# Altium project Freqency_counter.PrjPcb
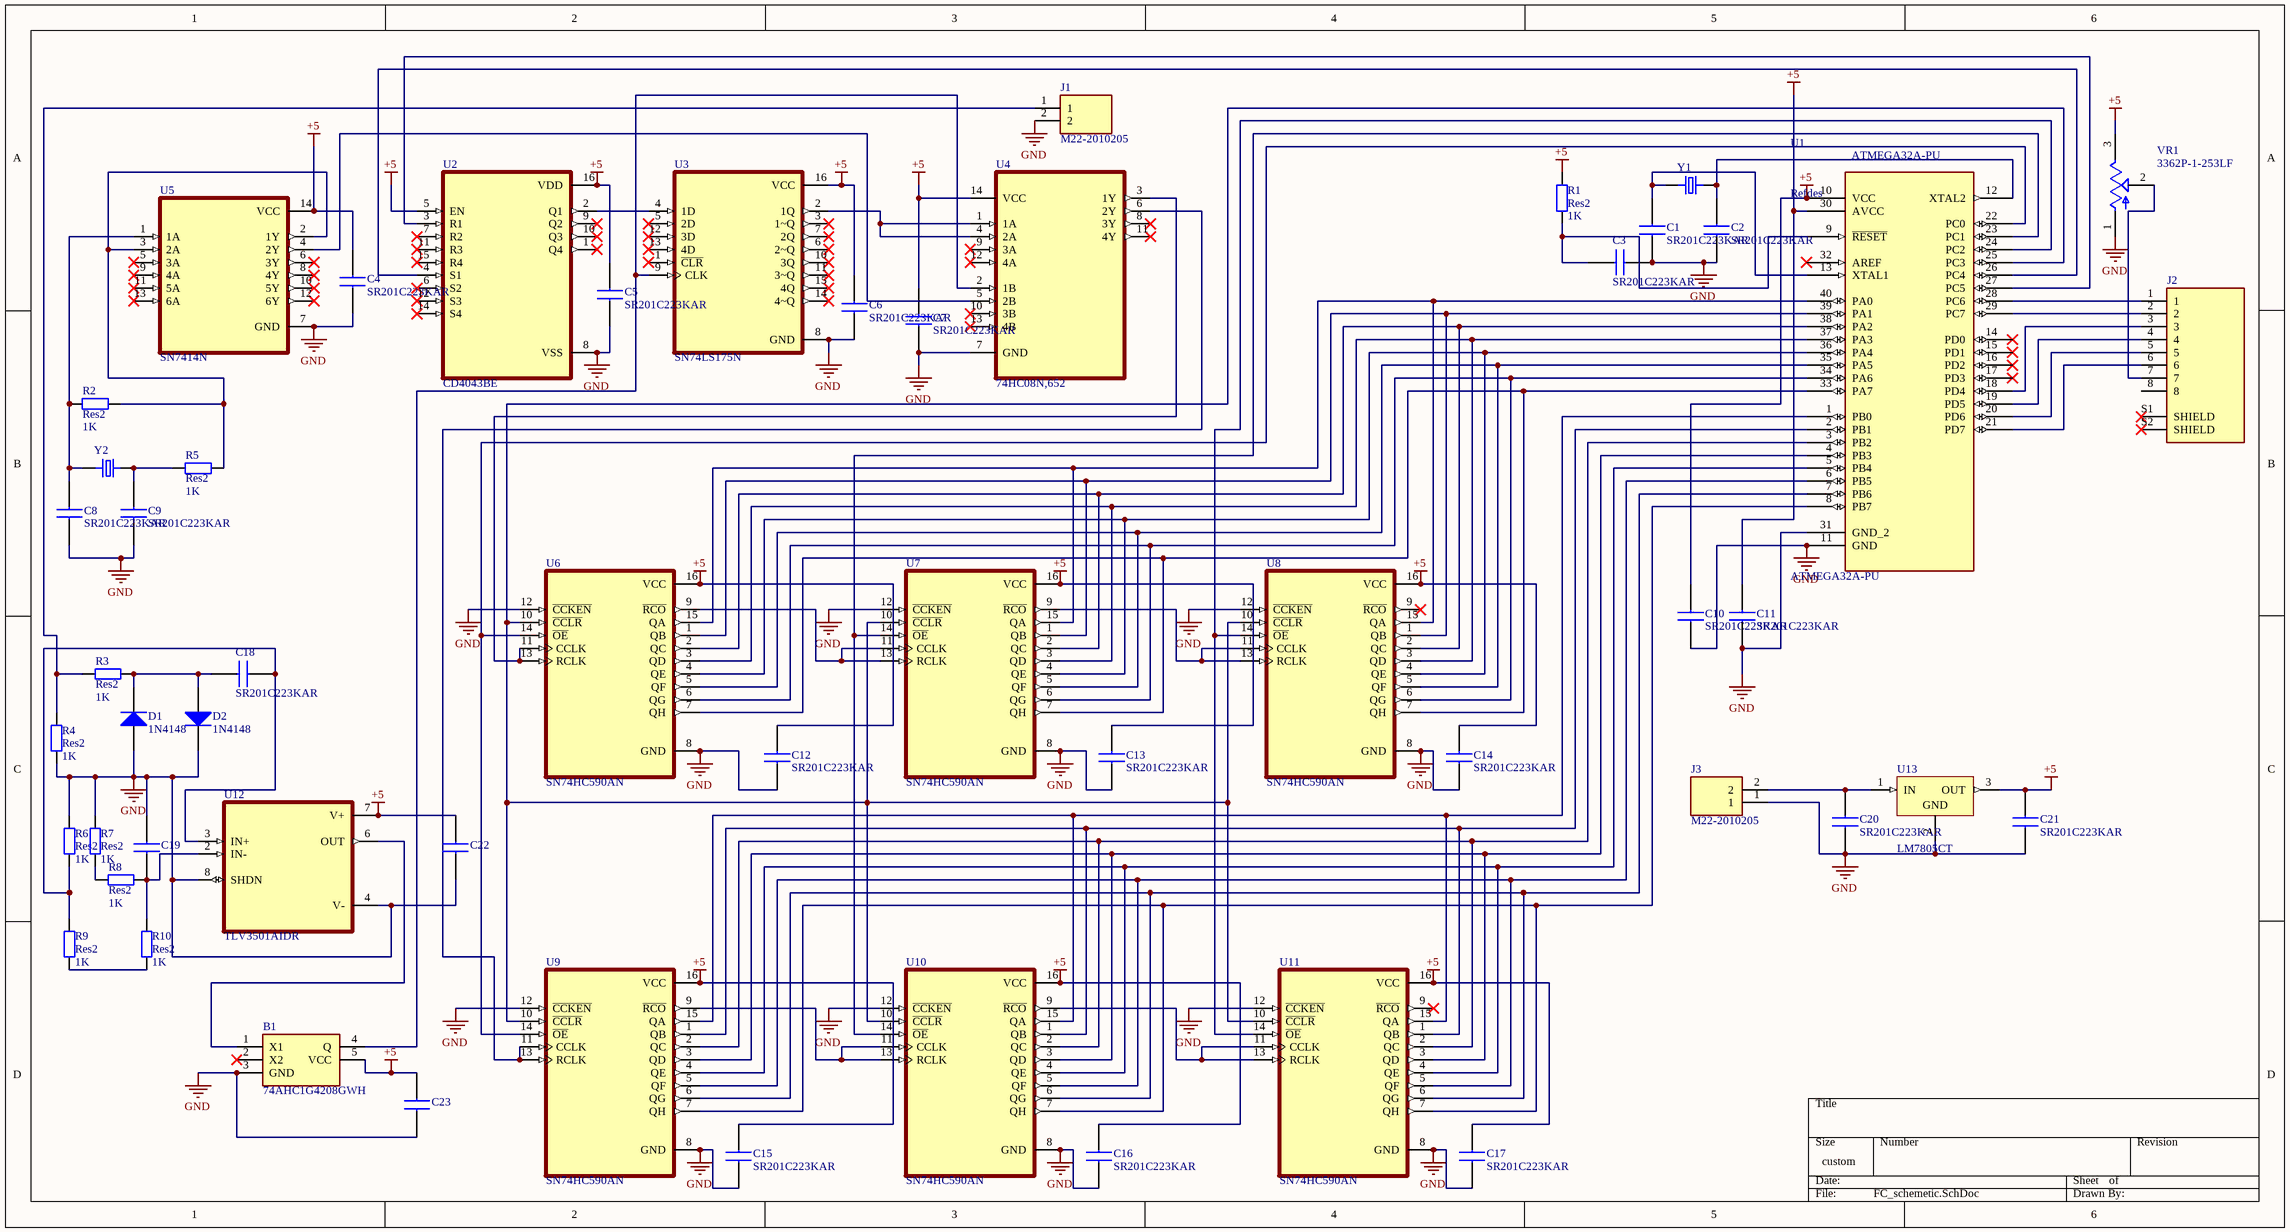
[diagram p0: FC_schemetic.SchDoc]
4 sheets, 110 parts. Net scope: global (net labels, ports and power ports of the same name join across sheets).
Board files: PCB.PcbDoc, PCB_final.PcbDoc
Sheets:
  FC_schemetic.SchDoc
  CPU.SchDoc
  Process.SchDoc
  Input.SchDoc

## Sheet FC_schemetic.SchDoc
size 449 x 241 mm; SheetNumber: 1; SheetTotal: 2; SPICEModelCacheGWGPYTAI: <root> / <DocumentId>GWGPYTAI</DocumentId> / <CacheFrame Number="0"> / <Model Name="xtal" Kind="CKT"> / <Text>*Generic type:crystal pkg:HC33/51 / .SUBCKT XTAL 1 2 PARAMS: FREQ=1Meg RS=750 C=13pf Q=1000 / LX 1 3 {((Q*RS)/(6.2831852*FREQ))} IC=0.5M / CX 3 4 {(1/(Q*6.2831852*FREQ*RS))} / C0 1 2 {C} / RS 4 2 {RS} / .ENDS XTAL</Text> / </Model> / <Model Name="cap" Kind="MDL"> / <Text>*Default semiconductor capacitor / .MODEL CAP C()</Text> / </Model> / <Model Name="11dq03" Kind="MDL"> / <Text>*11DQ03 MCE 7-17-95 / *Ref: IR Power Semiconductors Product Digest '94 / *MCE 30V 1.1A pkg:DIODE0.4 1,2 / .MODEL 11DQ03 D(IS=5.18E-9 RS=0.146 N=0.878 TT=4.32E-6 CJO=1.18E-10 / + VJ=0.75 M=0.333 EG=0.69 XTI=2 BV=30 IBV=6.01E-6 )</Text> / </Model> / </CacheFrame> / </root>

### Parts
B1  74AHC1G4208GWH  [SOT65P212X110-5N]
C1  SR201C223KAR  [AVX-SR20]
C2  SR201C223KAR  [AVX-SR20]
C3  SR201C223KAR  [AVX-SR20]
C4  SR201C223KAR  [AVX-SR20]
C5  SR201C223KAR  [AVX-SR20]
C6  SR201C223KAR  [AVX-SR20]
C7  SR201C223KAR  [AVX-SR20]
C8  SR201C223KAR  [AVX-SR20]
C9  SR201C223KAR  [AVX-SR20]
C10  SR201C223KAR  [AVX-SR20]
C11  SR201C223KAR  [AVX-SR20]
C12  SR201C223KAR  [AVX-SR20]
C13  SR201C223KAR  [AVX-SR20]
C14  SR201C223KAR  [AVX-SR20]
C15  SR201C223KAR  [AVX-SR20]
C16  SR201C223KAR  [AVX-SR20]
C17  SR201C223KAR  [AVX-SR20]
C18  SR201C223KAR  [AVX-SR20]
C19  SR201C223KAR  [AVX-SR20]  (value not drawn)
C20  SR201C223KAR  [AVX-SR20]
C21  SR201C223KAR  [AVX-SR20]
C22  SR201C223KAR  [AVX-SR20]  (value not drawn)
C23  SR201C223KAR  [AVX-SR20]  (value not drawn)
D1  1N4148  [NXP-SOD27-2_V]
D2  1N4148  [NXP-SOD27-2_V]
J1  M22-2010205  [HDRV2W50P0X200_1X2_400X200X525P]
J2  59453-082110EDHLF  [AMPHENOL_59453-082110EDHLF]  (value not drawn)
J3  M22-2010205  [HDRV2W50P0X200_1X2_400X200X525P]
R1  Res2  value 1K  [AXIAL-0.4]
R2  Res2  value 1K  [AXIAL-0.4]
R3  Res2  value 1K  [AXIAL-0.4]
R4  Res2  value 1K  [AXIAL-0.4]
R5  Res2  value 1K  [AXIAL-0.4]
R6  Res2  value 1K  [AXIAL-0.4]
R7  Res2  value 1K  [AXIAL-0.4]
R8  Res2  value 1K  [AXIAL-0.4]
R9  Res2  value 1K  [AXIAL-0.4]
R10  Res2  value 1K  [AXIAL-0.4]
U1  ATMEGA32A-PU  [DIP254P1524X482-40]
U2  CD4043BE  [DIP794W45P254L1969H508Q16]
U3  SN74LS175N  [DIP794W45P254L1969H508Q16]
U4  74HC08N,652  [DIP254P762X420-14]
U5  SN7414N  [DIP794W45P254L1969H508Q14]
U6  SN74HC590AN  [DIP794W45P254L1969H508Q16]
U7  SN74HC590AN  [DIP794W45P254L1969H508Q16]
U8  SN74HC590AN  [DIP794W45P254L1969H508Q16]
U9  SN74HC590AN  [DIP794W45P254L1969H508Q16]
U10  SN74HC590AN  [DIP794W45P254L1969H508Q16]
U11  SN74HC590AN  [DIP794W45P254L1969H508Q16]
U12  TLV3501AIDR  [SOIC127P599X175-8N]
U13  LM7805CT  [FAIR-TO-220-3]
VR1  3362P-1-253LF  [TRIM_3362P-1-253LF]
Y1  ECS-240.0001-18-1X  [XTAL_ECS-200-20-1X]  (value not drawn)
Y2  ECS-240.0001-18-1X  [XTAL_ECS-200-20-1X]  (value not drawn)

### Nets
+5: B1.3(GND) B1.5(VCC) C1.1 C2.1 C3.1 C4.1 C4.2 C5.1 C5.2 C6.1 C6.2 C7.1 C7.2 C8.1 C9.1 C10.1 C10.2 C11.1 C11.2 C12.1 C12.2 C13.1 C13.2 C14.1 C14.2 C15.1 C15.2 C16.1 C16.2 C17.1 C17.2 C19.1 C20.1 C21.1 C21.2 C22.1 C22.2 C23.1 C23.2 D1.1(A) D2.2(K) J1.2 J3.1 R1.2 R4.2 R6.1 R7.1 U1.10(VCC) U1.11(GND) U1.30(AVCC) U1.31(GND_2) U2.5(EN) U2.8(VSS) U2.16(VDD) U3.8(GND) U3.16(VCC) U4.7(GND) U4.14(VCC) U5.7(GND) U5.14(VCC) U6.8(GND) U6.12(~{CCKEN}) U6.16(VCC) U7.8(GND) U7.12(~{CCKEN}) U7.16(VCC) U8.8(GND) U8.12(~{CCKEN}) U8.16(VCC) U9.8(GND) U9.12(~{CCKEN}) U9.16(VCC) U10.8(GND) U10.12(~{CCKEN}) U10.16(VCC) U11.8(GND) U11.12(~{CCKEN}) U11.16(VCC) U12.4(V-) U12.7(V+) U12.8(SHDN) U13.2(GND) U13.3(OUT) VR1.1(CCW) VR1.3(CW)  [also labelled GND]  [project net Atmega_AVCC]
NetB1_1: B1.1(X1) U12.6(OUT)
NetB1_4: B1.4(Q) U3.9(CLK) U4.2(1B)
NetC1_2: C1.2 U1.13(XTAL1) Y1.1
NetC2_2: C2.2 U1.12(XTAL2) Y1.2
NetC3_2: C3.2 R1.1 U1.9(~{RESET})
NetC8_2: C8.2 R2.2 U5.1(1A) Y2.1
NetC9_2: C9.2 R5.2 Y2.2
NetC18_1: C18.1 R6.2 R9.1 U12.3(IN+)
NetC18_2: C18.2 D1.2(K) D2.1(A) R3.1
NetC19_2: C19.2 R8.2 R10.1 U12.2(IN-)
NetC20_2: C20.2 J3.2 U13.1(IN)
NetJ1_1: J1.1 R3.2 R4.1
NetJ2_1: J2.1 U1.28(PC6)
NetJ2_2: J2.2 U1.29(PC7)
NetJ2_3: J2.3 U1.18(PD4)
NetJ2_4: J2.4 U1.19(PD5)
NetJ2_5: J2.5 U1.20(PD6)
NetJ2_6: J2.6 U1.21(PD7)
NetJ2_7: J2.7 VR1.2(WIPER)
NetR2_1: R2.1 R5.1 U5.2(1Y) U5.3(2A)
NetR7_2: R7.2 R8.1
NetR9_2: R9.2 R10.2
NetU1_1: U1.1(PB0) U9.15(QA) U10.15(QA) U11.15(QA)
NetU1_2: U1.2(PB1) U9.1(QB) U10.1(QB) U11.1(QB)
NetU1_3: U1.3(PB2) U9.2(QC) U10.2(QC) U11.2(QC)
NetU1_4: U1.4(PB3) U9.3(QD) U10.3(QD) U11.3(QD)
NetU1_5: U1.5(PB4) U9.4(QE) U10.4(QE) U11.4(QE)
NetU1_6: U1.6(PB5) U9.5(QF) U10.5(QF) U11.5(QF)
NetU1_7: U1.7(PB6) U9.6(QG) U10.6(QG) U11.6(QG)
NetU1_8: U1.8(PB7) U9.7(QH) U10.7(QH) U11.7(QH)
NetU1_22: U1.22(PC0) U6.14(~{OE}) U9.14(~{OE})
NetU1_23: U1.23(PC1) U7.14(~{OE}) U10.14(~{OE})
NetU1_24: U1.24(PC2) U8.14(~{OE}) U11.14(~{OE})
NetU1_25: U1.25(PC3) U6.10(~{CCLR}) U7.10(~{CCLR}) U8.10(~{CCLR}) U9.10(~{CCLR}) U10.10(~{CCLR}) U11.10(~{CCLR})
NetU1_26: U1.26(PC4) U2.4(S1)
NetU1_27: U1.27(PC5) U2.3(R1)
NetU1_33: U1.33(PA7) U6.7(QH) U7.7(QH) U8.7(QH)
NetU1_34: U1.34(PA6) U6.6(QG) U7.6(QG) U8.6(QG)
NetU1_35: U1.35(PA5) U6.5(QF) U7.5(QF) U8.5(QF)
NetU1_36: U1.36(PA4) U6.4(QE) U7.4(QE) U8.4(QE)
NetU1_37: U1.37(PA3) U6.3(QD) U7.3(QD) U8.3(QD)
NetU1_38: U1.38(PA2) U6.2(QC) U7.2(QC) U8.2(QC)
NetU1_39: U1.39(PA1) U6.1(QB) U7.1(QB) U8.1(QB)
NetU1_40: U1.40(PA0) U6.15(QA) U7.15(QA) U8.15(QA)
NetU2_2: U2.2(Q1) U3.4(1D)
NetU3_2: U3.2(1Q) U4.1(1A) U4.4(2A)
NetU4_3: U4.3(1Y) U6.11(CCLK) U6.13(RCLK)
NetU4_5: U4.5(2B) U5.4(2Y)
NetU4_6: U4.6(2Y) U9.11(CCLK) U9.13(RCLK)
NetU6_9: U6.9(~{RCO}) U7.11(CCLK) U7.13(RCLK)
NetU7_9: U7.9(~{RCO}) U8.11(CCLK) U8.13(RCLK)
NetU9_9: U9.9(~{RCO}) U10.11(CCLK) U10.13(RCLK)
NetU10_9: U10.9(~{RCO}) U11.11(CCLK) U11.13(RCLK)

Not connected (* = marked no-connect by the designer): B1 2(X2)*; J2 8 S1(SHIELD)* S2(SHIELD)*; U1 14(PD0)* 15(PD1)* 16(PD2)* 17(PD3)* 32(AREF)*; U2 1(Q4)* 6(S2)* 7(R2)* 9(Q2)* 10(Q3)* 11(R3)* 12(S3)* 14(S4)* 15(R4)*; U3 1(~{CLR})* 3(1~Q)* 5(2D)* 6(2~Q)* 7(2Q)* 10(3Q)* 11(3~Q)* 12(3D)* 13(4D)* 14(4~Q)* 15(4Q)*; U4 8(3Y)* 9(3A)* 10(3B)* 11(4Y)* 12(4A)* 13(4B)*; U5 5(3A)* 6(3Y)* 8(4Y)* 9(4A)* 10(5Y)* 11(5A)* 12(6Y)* 13(6A)*; U8 9(~{RCO})*; U11 9(~{RCO})*

### Notes on the sheet
- (in symbol ATMEGA32A-PU) Refdes

### Library data of the parts
B1 = 74AHC1G4208GWH: vp_74AHC1G4208.ditamap - 8-stage divider and oscillator@en-us; Manufacturer_Name: Nexperia; Geometry.Height: 1.1mm; Manufacturer_Part_Number: 74AHC1G4208GWH; Mouser Part Number: 771-74AHC1G4208GWH; Mouser Price/Stock: https://www.mouser.co.uk/ProductDetail/Nexperia/74AHC1G4208GWH?qs=17u8i%2FzlE8%2FxKrIMt8zS2A%3D%3D; Arrow Part Number: 74AHC1G4208GWH; Arrow Price/Stock: https://www.arrow.com/en/products/74ahc1g4208gwh/nexperia?region=nac; Datasheet Link: https://assets.nexperia.com/documents/data-sheet/74AHC1G4208.pdf
C1-C23 = SR201C223KAR: Cap Ceramic 0.022uF 100V X7R 10% Radial 2.54mm 125C Bulk; Manufacturer_Name: AVX; Manufacturer_Part_Number: SR201C223KAR; Mouser Part Number: *; Mouser Price/Stock: *; Arrow Part Number: SR201C223KAR; Arrow Price/Stock: https://www.arrow.com/en/products/sr201c223kar/avx; Datasheet Link: http://datasheets.avx.com/SR-Series.pdf
D1 D2 = CMP-004-00000-2: High Speed Diode, 100 V, 0.45 A, -65 to 175 degC, 2-Pin SOD27, RoHS, Bulk; Manufacturer: Fairchild; Elements: 1; Recovery Time: 4ns; Forward Current: 300mA; Power: 500mW; Forward Voltage: 1V; Max Surge Current: 4A; Peak Reverse Current: 5uA; Datasheet URL: http://www.nxp.com/documents/data_sheet/1N4148_1N4448.pdf; Min Operating Temperature: -65°C; Manufacturer URL: https://www.fairchildsemi.com/; Packaging: Bulk; Diameter: 1.91mm; Pins: 2; Package URL: http://www.nxp.com/documents/data_sheet/1N4148_1N4448.pdf; Package Reference: SOD27; Max Operating Temperature: 175°C; Package Quantity: 2000; Case/Package: DO; Datasheet Version: Aug-04; RoHS Compliant: True
J1 J3 = M22-2010205: Header, SIL, vertical, 2 way, 2mm pitch HARWIN M22-20 Series, 2mm Pitch 2 Way 1 Row Straight PCB Header, Solder Termination, 1A; Geometry.Height: 5.25mm; Manufacturer_Name: Harwin; Manufacturer_Part_Number: M22-2010205; Mouser Part Number: 855-M22-2010205; Mouser Price/Stock: https://www.mouser.co.uk/ProductDetail/Harwin/M22-2010205?qs=xxdqPuaJ%252Ba2I8VeWvpQIzQ%3D%3D; Arrow Part Number: *; Arrow Price/Stock: *; Datasheet Link: http://uk.rs-online.com/web/p/products/6813287
J2 = 59453-082110EDHLF: 0.50mm Flex Connectors, FPC/FFC Side Entry ZIF Connector, Surface Mount, 8 Positions, Top Contact, 0.50mm (0.020in) Pitch; MF: Amphenol ICC (FCI); Price: None; Package: None; Value: *; Check_prices: https://www.snapeda.com/parts/59453-082110EDHLF/Amphenol%20FCI/view-part/5519599/?ref=eda; SnapEDA_Link: https://www.snapeda.com/parts/59453-082110EDHLF/Amphenol%20FCI/view-part/5519599/?ref=snap; Availability: In Stock; MP: 59453-082110EDHLF
R1-R10 = Res2: Resistor; Published: 8-Jun-2000; LatestRevisionDate: 17-Jul-2002; LatestRevisionNote: Re-released for DXP Platform.; PackageReference: AXIAL-0.4; Publisher: Altium Limited; PackageDescription: Axial Device, Thru-Hole; 2 Leads; 0.4 in Pin Spacing
U1 = ATMEGA32A-PU: AVR AVRÂ® ATmega Microcontroller IC 8-Bit 16MHz 32KB (16K x 16) FLASH 40-PDIP; MF: Microchip; Price: None; Availability: In Stock; Package: PDIP-40 Microchip; MP: ATMEGA32A-PU; Value: *; SnapEDA_Link: https://www.snapeda.com/parts/ATMEGA32A-PU/Microchip/view-part/?ref=snap; Purchase-URL: https://pricing.snapeda.com/search/part/ATMEGA32A-PU/?ref=eda; Check_prices: https://www.snapeda.com/parts/ATMEGA32A-PU/Microchip/view-part/?ref=eda
U2 = CD4043BE: CMOS Quad NOR R/S Latch with 3-State Outputs 16-PDIP -55 to 125; MF: Texas Instruments; Value: *; Arrow_Electronics-Purchase-URL: https://snapeda.com/shop?store=Arrow+Electronics&id=577167; Package: PDIP-16 Texas Instruments; DigiKey-Purchase-URL: https://snapeda.com/shop?store=DigiKey&id=577167; Mouser-Purchase-URL: https://snapeda.com/shop?store=Mouser&id=577167; Price: None; MP: CD4043BE; Availability: Good; SnapEDA_Link: https://www.snapeda.com/parts/CD4043BE/Texas%20Instruments/view-part/577167/?ref=snap; Texas_Instruments-Purchase-URL: https://snapeda.com/shop?store=Texas+Instruments&id=577167; BuyPart: https://www.snapeda.com/parts/CD4043BE/Texas%20Instruments/view-part/577167/?ref=eda
U3 = SN74LS175N: Quadruple D-Type Flip-Flops With Clear 16-PDIP 0 to 70; MF: Texas Instruments; MP: SN74LS175N; SnapEDA_Link: https://www.snapeda.com/parts/SN74LS175N/Texas%20Instruments/view-part/572262/?ref=snap; Package: PDIP-16 Texas Instruments; Value: *; Check_prices: https://www.snapeda.com/parts/SN74LS175N/Texas%20Instruments/view-part/572262/?ref=eda; Purchase-URL: https://pricing.snapeda.com/search/part/SN74LS175N/?ref=eda; Digi-Key_Part_Number: 296-28719-2-ND
U4 = 74HC08N,652: AND Gate IC 4 Channel 14-DIP; MF: NXP USA; Availability: Warning; MP: 74HC08N,652; DigiKey-Purchase-URL: https://snapeda.com/shop?store=DigiKey&id=41634; Value: *; SnapEDA_Link: https://www.snapeda.com/parts/74HC08N,652/NXP%20USA%20Inc./view-part/41634/?ref=snap; Price: None; Package: DIP-14 NXP Semiconductors; BuyPart: https://www.snapeda.com/parts/74HC08N,652/NXP%20USA%20Inc./view-part/41634/?ref=eda
U5 = SN7414N: Hex schmitt-trigger inverters 14-PDIP 0 to 70; MF: Texas Instruments; Price: None; MP: SN7414N; DigiKey-Purchase-URL: https://snapeda.com/shop?store=DigiKey&id=51455; Value: *; Package: PDIP-14 Texas Instruments; Mouser-Purchase-URL: https://snapeda.com/shop?store=Mouser&id=51455; SnapEDA_Link: https://www.snapeda.com/parts/SN7414N/Texas%20Instruments/view-part/51455/?ref=snap; Availability: Warning; Texas_Instruments-Purchase-URL: https://snapeda.com/shop?store=Texas+Instruments&id=51455; Check_prices: https://www.snapeda.com/parts/SN7414N/Texas%20Instruments/view-part/51455/?ref=eda
U6-U11 = SN74HC590AN: 8-Bit Binary Counters With 3-State Output Registers 16-PDIP -40 to 85; MF: Texas Instruments; Value: *; MP: SN74HC590AN; SnapEDA_Link: https://www.snapeda.com/parts/SN74HC590AN/Texas%20Instruments/view-part/385662/?ref=snap; Package: PDIP-16 Texas Instruments; Digi-Key_Part_Number: SN74HC590ANG4-ND; Texas_Instruments-Purchase-URL: https://snapeda.com/shop?store=Texas+Instruments&id=385662; BuyPart: https://www.snapeda.com/parts/SN74HC590AN/Texas%20Instruments/view-part/385662/?ref=eda
U12 = TLV3501AIDR: 4.5ns, Rail-to-Rail, High Speed Comparator with Shutdown 8-SOIC -40 to 125; MF: Texas Instruments; MP: TLV3501AIDR; Purchase-URL: https://pricing.snapeda.com/search/part/TLV3501AIDR/?ref=eda; Package: SOIC-8 Texas Instruments; Value: *; Digi-Key_Part_Number: 296-43611-1-ND; Check_prices: https://www.snapeda.com/parts/TLV3501AIDR/Texas+Instruments/view-part/?ref=eda; SnapEDA_Link: https://www.snapeda.com/parts/TLV3501AIDR/Texas+Instruments/view-part/?ref=snap
U13 = CMP-2000-04938-1: Positive Voltage Regulator, 5 V, 1 A, -40 to 125 degC, 3-Pin TO-220, RoHS, Tube; Manufacturer: FairchildSemiconductor; Maximum Input Voltage: 35V; Maximum Quiescent Current: 8mA; Load Regulation: 100mV; Maximum Output Current: 2.2(Typ)A; Output Type: Fixed; Typical Dropout Voltage @ Current: 2@1AV; Rad Hard: No; Output Voltage: 5V; Accuracy: ±4%; Number of Outputs: 1; Category: LinearRegulator; Package Description: 3-Pin Through Hole Device, Body 10 x 4.5 mm, Pitch 2.54 mm; Packaging: Rail/Tube; Mounting: ThroughHole; Polarity: Positive; Manufacturer URL: https://www.fairchildsemi.com/; Line Regulation: 100mV; Datasheet Version: Aug-12; Datasheet URL: https://datasheet.ciiva.com/26904/lm7805ct-26904988.pdf; Package Reference: TO-220; Package URL: https://www.fairchildsemi.com/package-drawings/TO/TO220B03.pdf; Package: 3TO-220AB; Operating Temperature: -40to125degC; Type: Linear
VR1 = 3362P-1-253LF: 25 kOhms 0.5W, 1/2W PC Pins Through Hole Trimmer Potentiometer Cermet 1 Turn Top Adjustment; MF: Bourns; Check_prices: https://www.snapeda.com/parts/3362P-1-253LF/Bourns/view-part/493663/?ref=eda; SnapEDA_Link: https://www.snapeda.com/parts/3362P-1-253LF/Bourns/view-part/493663/?ref=snap; Availability: Good; Value: *; Purchase-URL: https://pricing.snapeda.com/search/part/3362P-1-253LF/?ref=eda; Price: None; MP: 3362P-1-253LF; Package: 3116 Bourns
Y1 Y2 = ECS-240.0001-18-1X: Crystals / Oscillators / Resonators 24.00014MHz 18pF; MF: ECS International; Package: HC49/U ECS International; Availability: Unavailable; Value: *; MP: ECS-240.0001-18-1X; Price: None; SnapEDA_Link: https://www.snapeda.com/parts/ECS-240.0001-18-1X/ECS%20International/view-part/259232/?ref=snap

## Sheet CPU.SchDoc
size 297 x 209 mm; SheetNumber: 2; SheetTotal: 4
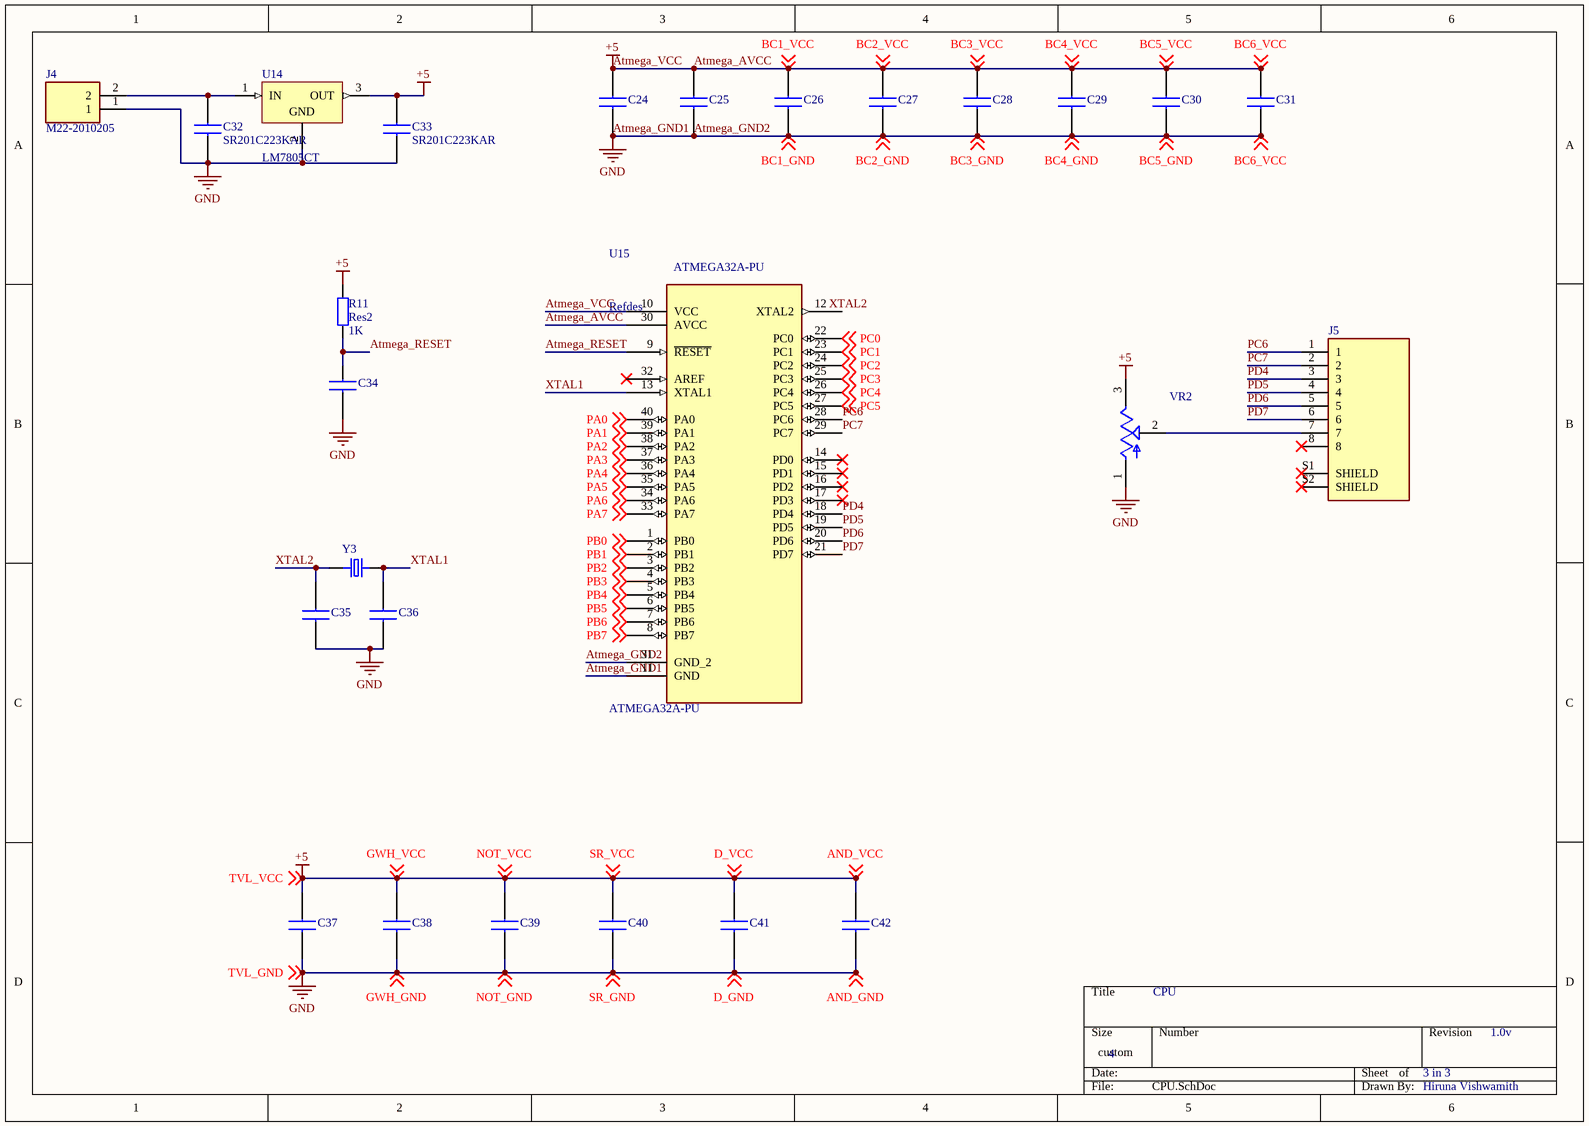
[diagram p1: CPU.SchDoc]

### Parts
C24  SR201C223KAR  [AVX-SR20]  (value not drawn)
C25  SR201C223KAR  [AVX-SR20]  (value not drawn)
C26  SR201C223KAR  [AVX-SR20]  (value not drawn)
C27  SR201C223KAR  [AVX-SR20]  (value not drawn)
C28  SR201C223KAR  [AVX-SR20]  (value not drawn)
C29  SR201C223KAR  [AVX-SR20]  (value not drawn)
C30  SR201C223KAR  [AVX-SR20]  (value not drawn)
C31  SR201C223KAR  [AVX-SR20]  (value not drawn)
C32  SR201C223KAR  [AVX-SR20]
C33  SR201C223KAR  [AVX-SR20]
C34  SR201C223KAR  [AVX-SR20]  (value not drawn)
C35  SR201C223KAR  [AVX-SR20]  (value not drawn)
C36  SR201C223KAR  [AVX-SR20]  (value not drawn)
C37  SR201C223KAR  [AVX-SR20]  (value not drawn)
C38  SR201C223KAR  [AVX-SR20]  (value not drawn)
C39  SR201C223KAR  [AVX-SR20]  (value not drawn)
C40  SR201C223KAR  [AVX-SR20]  (value not drawn)
C41  SR201C223KAR  [AVX-SR20]  (value not drawn)
C42  SR201C223KAR  [AVX-SR20]  (value not drawn)
J4  M22-2010205  [HDRV2W50P0X200_1X2_400X200X525P]
J5  59453-082110EDHLF  [AMPHENOL_59453-082110EDHLF]  (value not drawn)
R11  Res2  value 1K  [AXIAL-0.4]
U14  LM7805CT  [FAIR-TO-220-3]
U15  ATMEGA32A-PU  [DIP254P1524X482-40]
VR2  3362P-1-253LF  [TRIM_3362P-1-253LF]  (value not drawn)
Y3  ECS-240.0001-18-1X  [XTAL_ECS-200-20-1X]  (value not drawn)

### Nets
Atmega_AVCC: C24.1 C24.2 C25.1 C25.2 C26.1 C26.2 C27.1 C27.2 C28.1 C28.2 C29.1 C29.2 C30.1 C30.2 C31.1 C31.2 C32.1 C33.1 C33.2 C34.2 C35.1 C36.1 C37.1 C37.2 C38.1 C38.2 C39.1 C39.2 C40.1 C40.2 C41.1 C41.2 C42.1 C42.2 J4.1 R11.2 U14.2(GND) U14.3(OUT) U15.10(VCC) U15.11(GND) U15.30(AVCC) U15.31(GND_2) VR2.1(CCW) VR2.3(CW) ; off-sheet BC1_VCC, off-sheet BC2_VCC, off-sheet BC1_GND, off-sheet BC2_GND, off-sheet BC3_GND, off-sheet BC3_VCC, off-sheet BC4_VCC, off-sheet BC5_VCC, off-sheet BC6_VCC, off-sheet BC4_GND, off-sheet BC5_GND, off-sheet GWH_VCC, off-sheet GWH_GND, off-sheet NOT_VCC, off-sheet NOT_GND, off-sheet SR_VCC, off-sheet SR_GND, off-sheet TVL_VCC, off-sheet TVL_GND, off-sheet D_VCC, off-sheet AND_VCC, off-sheet D_GND, off-sheet AND_GND  [also labelled +5, AND_GND, AND_VCC, Atmega_GND1, Atmega_GND2, Atmega_VCC, BC1_GND, BC1_VCC, BC2_GND, BC2_VCC, BC3_GND, BC3_VCC, BC4_GND, BC4_VCC, BC5_GND, BC5_VCC, BC6_VCC, D_GND, D_VCC, GND, GWH_GND, GWH_VCC, NOT_GND, NOT_VCC, SR_GND, SR_VCC, TVL_GND, TVL_VCC]
Atmega_RESET: C34.1 R11.1 U15.9(~{RESET})
PA0: U15.40(PA0) ; off-sheet PA0
PA1: U15.39(PA1) ; off-sheet PA1
PA2: U15.38(PA2) ; off-sheet PA2
PA3: U15.37(PA3) ; off-sheet PA3
PA4: U15.36(PA4) ; off-sheet PA4
PA5: U15.35(PA5) ; off-sheet PA5
PA6: U15.34(PA6) ; off-sheet PA6
PA7: U15.33(PA7) ; off-sheet PA7
PB0: U15.1(PB0) ; off-sheet PB0
PB1: U15.2(PB1) ; off-sheet PB1
PB2: U15.3(PB2) ; off-sheet PB2
PB3: U15.4(PB3) ; off-sheet PB3
PB4: U15.5(PB4) ; off-sheet PB4
PB5: U15.6(PB5) ; off-sheet PB5
PB6: U15.7(PB6) ; off-sheet PB6
PB7: U15.8(PB7) ; off-sheet PB7
PC0: U15.22(PC0) ; off-sheet PC0
PC1: U15.23(PC1) ; off-sheet PC1
PC2: U15.24(PC2) ; off-sheet PC2
PC3: U15.25(PC3) ; off-sheet PC3
PC4: U15.26(PC4) ; off-sheet PC4
PC5: U15.27(PC5) ; off-sheet PC5
PC6: J5.1 U15.28(PC6)
PC7: J5.2 U15.29(PC7)
PD4: J5.3 U15.18(PD4)
PD5: J5.4 U15.19(PD5)
PD6: J5.5 U15.20(PD6)
PD7: J5.6 U15.21(PD7)
XTAL1: C36.2 U15.13(XTAL1) Y3.2
XTAL2: C35.2 Y3.1
NetC32_2: C32.2 J4.2 U14.1(IN)
NetJ5_7: J5.7 VR2.2(WIPER)

Not connected (* = marked no-connect by the designer): J5 8* S1(SHIELD)* S2(SHIELD)*; U15 12(XTAL2) 14(PD0)* 15(PD1)* 16(PD2)* 17(PD3)* 32(AREF)*

### Notes on the sheet
- CPU
- 4
- 3 in 3
- 1.0v
- Hiruna Vishwamith
- Labels drawn without touching a wire or pin: XTAL2
- (in symbol ATMEGA32A-PU) Refdes

### Library data of the parts
C24-C42 = SR201C223KAR: as C1 on sheet FC_schemetic; Manufacturer_Part_Number: SR201C223KAR; Mouser Part Number: *; Mouser Price/Stock: *; Arrow Part Number: SR201C223KAR; Arrow Price/Stock: https://www.arrow.com/en/products/sr201c223kar/avx; Datasheet Link: http://datasheets.avx.com/SR-Series.pdf
J4 = M22-2010205: as J1 on sheet FC_schemetic; Manufacturer_Name: Harwin; Manufacturer_Part_Number: M22-2010205; Mouser Part Number: 855-M22-2010205; Mouser Price/Stock: https://www.mouser.co.uk/ProductDetail/Harwin/M22-2010205?qs=xxdqPuaJ%252Ba2I8VeWvpQIzQ%3D%3D; Arrow Part Number: *; Arrow Price/Stock: *; Datasheet Link: http://uk.rs-online.com/web/p/products/6813287
J5 = 59453-082110EDHLF: as J2 on sheet FC_schemetic; Price: None; Package: None; Value: *; Check_prices: https://www.snapeda.com/parts/59453-082110EDHLF/Amphenol%20FCI/view-part/5519599/?ref=eda; SnapEDA_Link: https://www.snapeda.com/parts/59453-082110EDHLF/Amphenol%20FCI/view-part/5519599/?ref=snap; Availability: In Stock; MP: 59453-082110EDHLF
R11 = Res2: Resistor; Published: 8-Jun-2000; LatestRevisionDate: 17-Jul-2002; LatestRevisionNote: Re-released for DXP Platform.; PackageReference: AXIAL-0.4; Publisher: Altium Limited; PackageDescription: Axial Device, Thru-Hole; 2 Leads; 0.4 in Pin Spacing
U14 = CMP-2000-04938-1: as U13 on sheet FC_schemetic; Category: LinearRegulator; Package Description: 3-Pin Through Hole Device, Body 10 x 4.5 mm, Pitch 2.54 mm; Packaging: Rail/Tube; Mounting: ThroughHole; Polarity: Positive; Manufacturer URL: https://www.fairchildsemi.com/; Line Regulation: 100mV; Datasheet Version: Aug-12; Datasheet URL: https://datasheet.ciiva.com/26904/lm7805ct-26904988.pdf; Package Reference: TO-220; Package URL: https://www.fairchildsemi.com/package-drawings/TO/TO220B03.pdf; Package: 3TO-220AB; Operating Temperature: -40to125degC; Type: Linear
U15 = ATMEGA32A-PU: as U1 on sheet FC_schemetic; Price: None; Availability: In Stock; Package: PDIP-40 Microchip; MP: ATMEGA32A-PU; Value: *; SnapEDA_Link: https://www.snapeda.com/parts/ATMEGA32A-PU/Microchip/view-part/?ref=snap; Purchase-URL: https://pricing.snapeda.com/search/part/ATMEGA32A-PU/?ref=eda; Check_prices: https://www.snapeda.com/parts/ATMEGA32A-PU/Microchip/view-part/?ref=eda
VR2 = 3362P-1-253LF: as VR1 on sheet FC_schemetic; Check_prices: https://www.snapeda.com/parts/3362P-1-253LF/Bourns/view-part/493663/?ref=eda; SnapEDA_Link: https://www.snapeda.com/parts/3362P-1-253LF/Bourns/view-part/493663/?ref=snap; Availability: Good; Value: *; Purchase-URL: https://pricing.snapeda.com/search/part/3362P-1-253LF/?ref=eda; Price: None; MP: 3362P-1-253LF; Package: 3116 Bourns
Y3 = ECS-240.0001-18-1X: as Y1 on sheet FC_schemetic; Package: HC49/U ECS International; Availability: Unavailable; Value: *; MP: ECS-240.0001-18-1X; Price: None; SnapEDA_Link: https://www.snapeda.com/parts/ECS-240.0001-18-1X/ECS%20International/view-part/259232/?ref=snap

## Sheet Process.SchDoc
size 297 x 209 mm; SheetNumber: 3; SheetTotal: 4
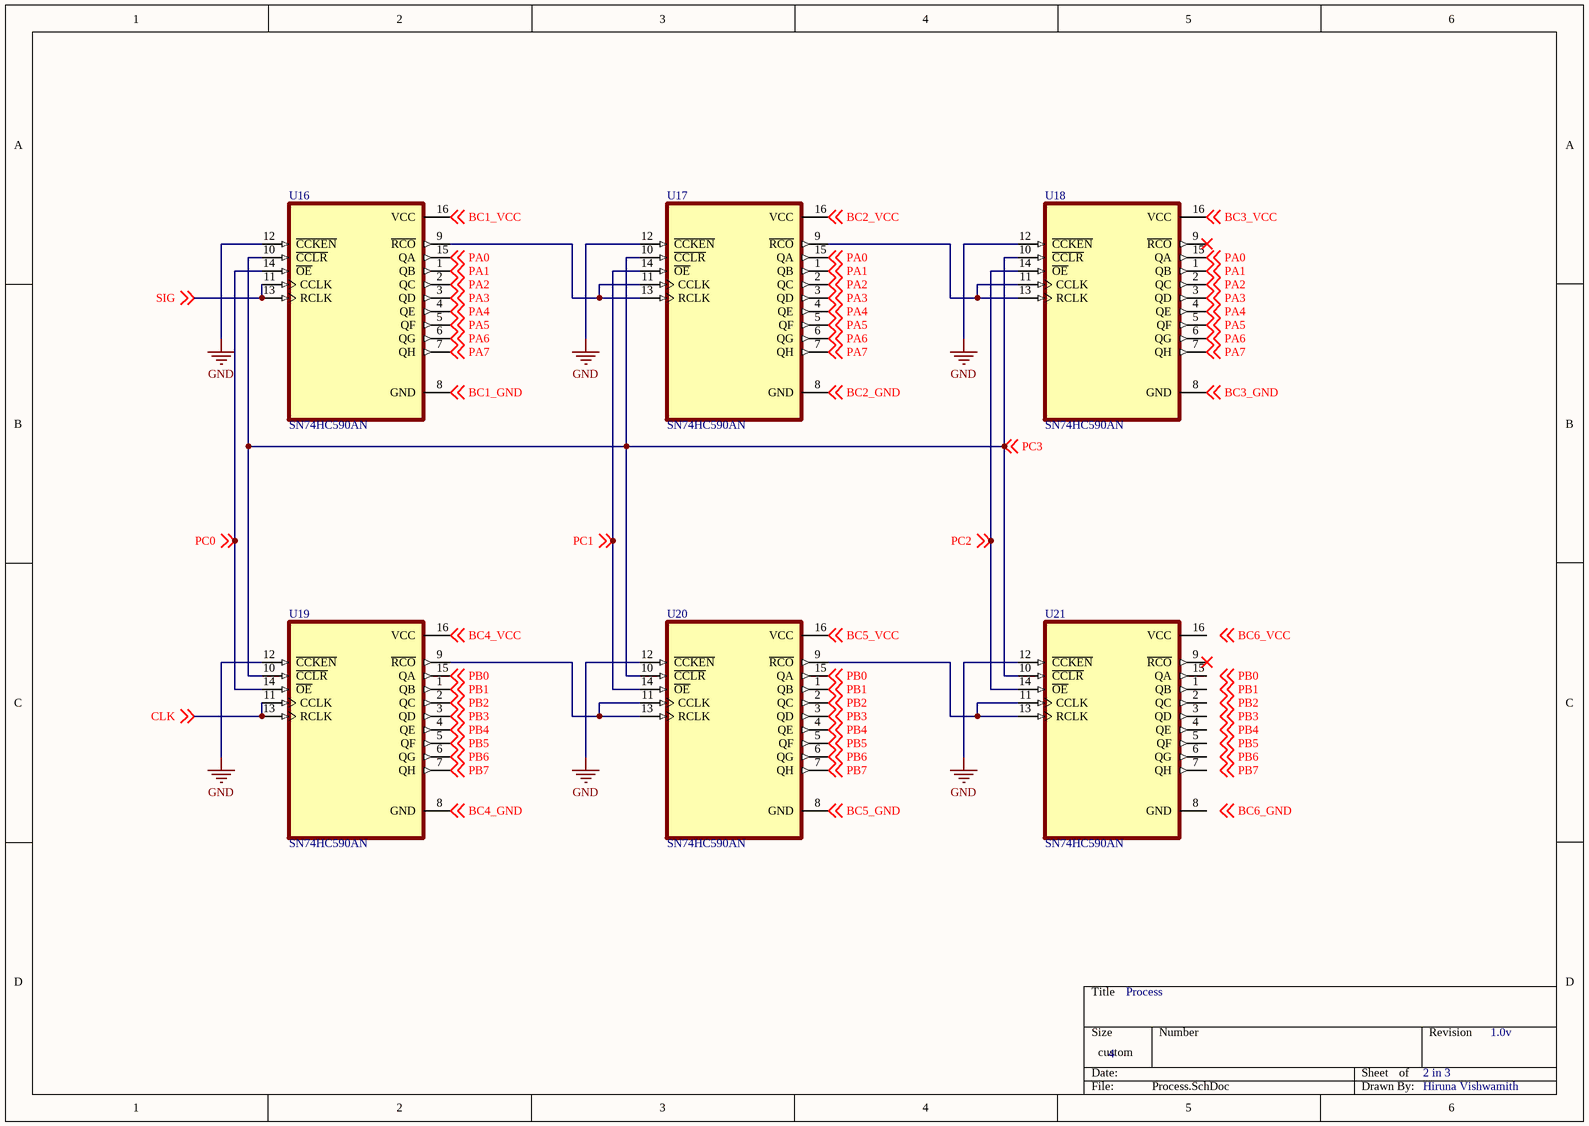
[diagram p2: Process.SchDoc]

### Parts
U16  SN74HC590AN  [DIP794W45P254L1969H508Q16]
U17  SN74HC590AN  [DIP794W45P254L1969H508Q16]
U18  SN74HC590AN  [DIP794W45P254L1969H508Q16]
U19  SN74HC590AN  [DIP794W45P254L1969H508Q16]
U20  SN74HC590AN  [DIP794W45P254L1969H508Q16]
U21  SN74HC590AN  [DIP794W45P254L1969H508Q16]

### Nets
BC1_GND: U16.8(GND) U16.12(~{CCKEN}) U16.16(VCC) U17.8(GND) U17.12(~{CCKEN}) U17.16(VCC) U18.8(GND) U18.12(~{CCKEN}) U18.16(VCC) U19.8(GND) U19.12(~{CCKEN}) U19.16(VCC) U20.8(GND) U20.12(~{CCKEN}) U20.16(VCC) U21.12(~{CCKEN}) ; off-sheet BC1_VCC, off-sheet BC1_GND, off-sheet BC2_VCC, off-sheet BC2_GND, off-sheet BC3_VCC, off-sheet BC3_GND, off-sheet BC6_VCC, off-sheet BC5_VCC, off-sheet BC5_GND, off-sheet BC4_VCC, off-sheet BC4_GND  [also labelled BC1_VCC, BC2_GND, BC2_VCC, BC3_GND, BC3_VCC, BC4_GND, BC4_VCC, BC5_GND, BC5_VCC, BC6_VCC, GND]  [project net Atmega_AVCC]
CLK: U19.11(CCLK) U19.13(RCLK) ; off-sheet CLK
PA0: U16.15(QA) U17.15(QA) U18.15(QA) ; off-sheet PA0
PA1: U16.1(QB) U17.1(QB) U18.1(QB) ; off-sheet PA1
PA2: U16.2(QC) U17.2(QC) U18.2(QC) ; off-sheet PA2
PA3: U16.3(QD) U17.3(QD) U18.3(QD) ; off-sheet PA3
PA4: U16.4(QE) U17.4(QE) U18.4(QE) ; off-sheet PA4
PA5: U16.5(QF) U17.5(QF) U18.5(QF) ; off-sheet PA5
PA6: U16.6(QG) U17.6(QG) U18.6(QG) ; off-sheet PA6
PA7: U16.7(QH) U17.7(QH) U18.7(QH) ; off-sheet PA7
PB0: U19.15(QA) U20.15(QA) ; off-sheet PB0
PB1: U19.1(QB) U20.1(QB) ; off-sheet PB1
PB2: U19.2(QC) U20.2(QC) ; off-sheet PB2
PB3: U19.3(QD) U20.3(QD) ; off-sheet PB3
PB4: U19.4(QE) U20.4(QE) ; off-sheet PB4
PB5: U19.5(QF) U20.5(QF) ; off-sheet PB5
PB6: U19.6(QG) U20.6(QG) ; off-sheet PB6
PB7: U19.7(QH) U20.7(QH) ; off-sheet PB7
PC0: U16.14(~{OE}) U19.14(~{OE}) ; off-sheet PC0
PC1: U17.14(~{OE}) U20.14(~{OE}) ; off-sheet PC1
PC2: U18.14(~{OE}) U21.14(~{OE}) ; off-sheet PC2
PC3: U16.10(~{CCLR}) U17.10(~{CCLR}) U18.10(~{CCLR}) U19.10(~{CCLR}) U20.10(~{CCLR}) U21.10(~{CCLR}) ; off-sheet PC3
SIG: U16.11(CCLK) U16.13(RCLK) ; off-sheet SIG
NetU16_9: U16.9(~{RCO}) U17.11(CCLK) U17.13(RCLK)
NetU17_9: U17.9(~{RCO}) U18.11(CCLK) U18.13(RCLK)
NetU19_9: U19.9(~{RCO}) U20.11(CCLK) U20.13(RCLK)
NetU20_9: U20.9(~{RCO}) U21.11(CCLK) U21.13(RCLK)

Not connected (* = marked no-connect by the designer): U18 9(~{RCO})*; U21 1(QB) 2(QC) 3(QD) 4(QE) 5(QF) 6(QG) 7(QH) 8(GND) 9(~{RCO})* 15(QA) 16(VCC)

### Notes on the sheet
- Process
- 4
- 2 in 3
- 1.0v
- Hiruna Vishwamith
- Labels drawn without touching a wire or pin: BC6_GND, BC6_VCC, PB0, PB1, PB2, PB3, PB4, PB5, PB6, PB7

### Library data of the parts
U16-U21 = SN74HC590AN: as U6 on sheet FC_schemetic; Value: *; MP: SN74HC590AN; SnapEDA_Link: https://www.snapeda.com/parts/SN74HC590AN/Texas%20Instruments/view-part/385662/?ref=snap; Package: PDIP-16 Texas Instruments; Digi-Key_Part_Number: SN74HC590ANG4-ND; Texas_Instruments-Purchase-URL: https://snapeda.com/shop?store=Texas+Instruments&id=385662; BuyPart: https://www.snapeda.com/parts/SN74HC590AN/Texas%20Instruments/view-part/385662/?ref=eda

## Sheet Input.SchDoc
size 297 x 209 mm; SheetNumber: 4; SheetTotal: 4
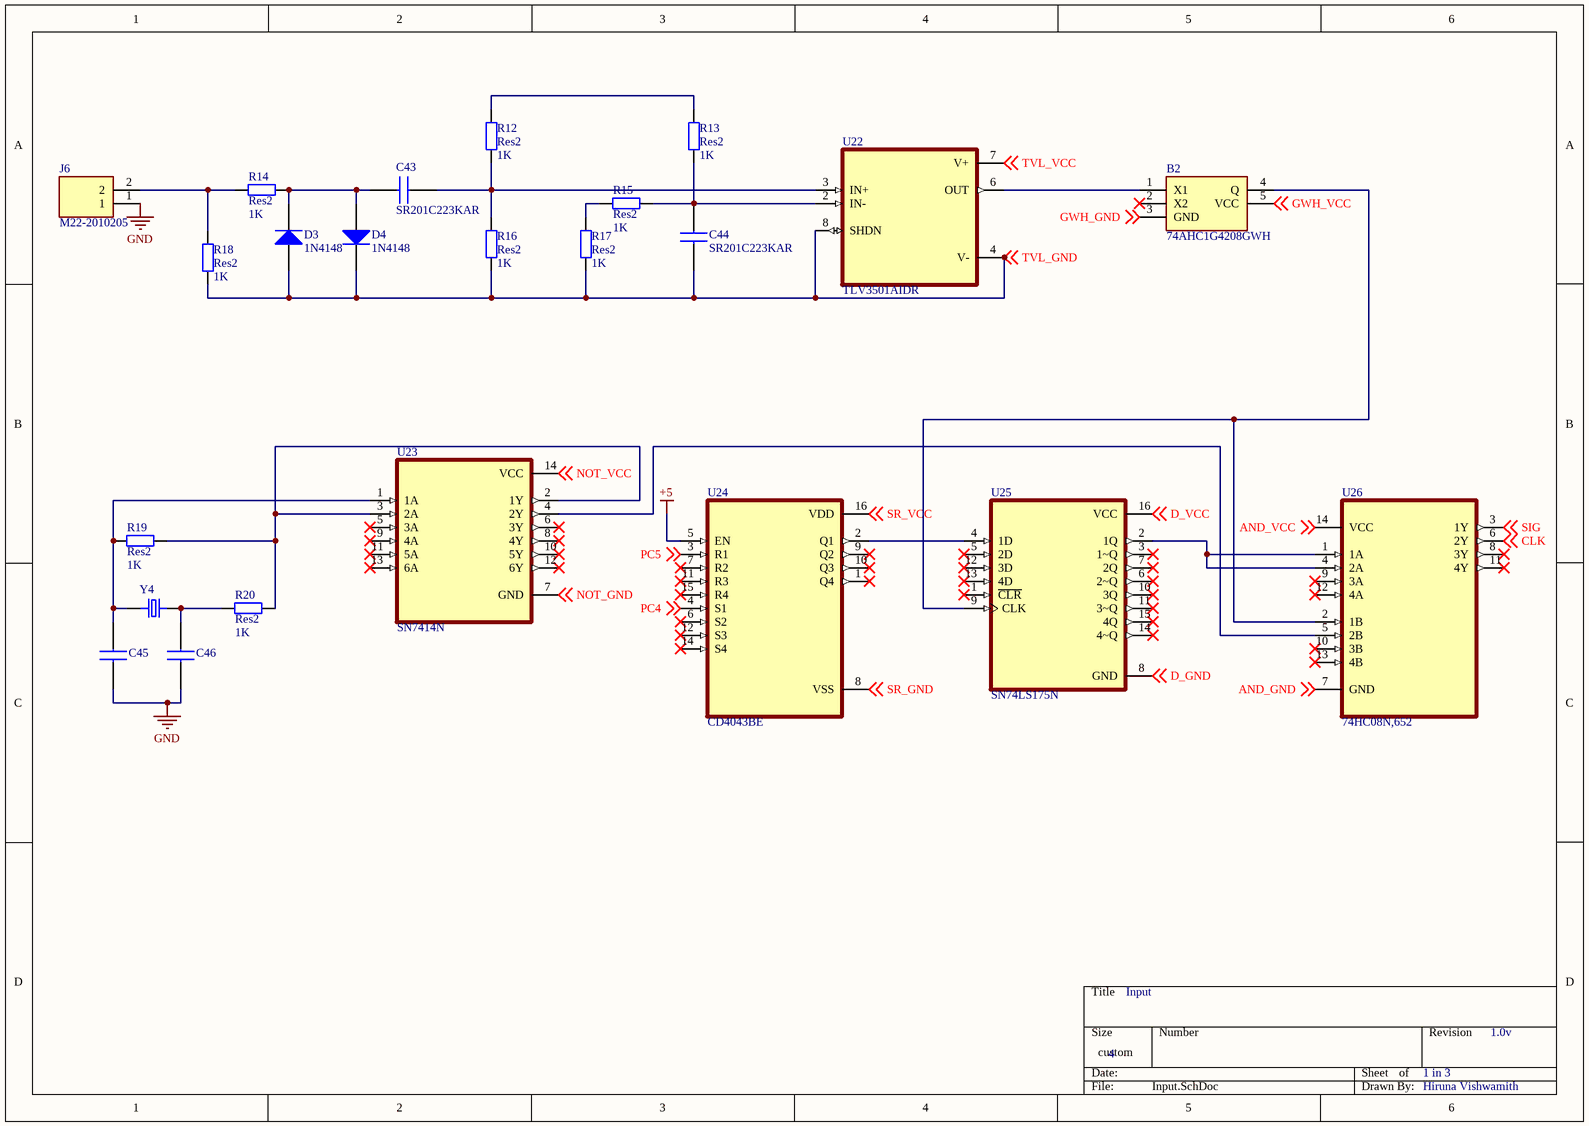
[diagram p3: Input.SchDoc]

### Parts
B2  74AHC1G4208GWH  [SOT65P212X110-5N]
C43  SR201C223KAR  [AVX-SR20]
C44  SR201C223KAR  [AVX-SR20]
C45  SR201C223KAR  [AVX-SR20]  (value not drawn)
C46  SR201C223KAR  [AVX-SR20]  (value not drawn)
D3  1N4148  [NXP-SOD27-2_V]
D4  1N4148  [NXP-SOD27-2_V]
J6  M22-2010205  [HDRV2W50P0X200_1X2_400X200X525P]
R12  Res2  value 1K  [AXIAL-0.4]
R13  Res2  value 1K  [AXIAL-0.4]
R14  Res2  value 1K  [AXIAL-0.4]
R15  Res2  value 1K  [AXIAL-0.4]
R16  Res2  value 1K  [AXIAL-0.4]
R17  Res2  value 1K  [AXIAL-0.4]
R18  Res2  value 1K  [AXIAL-0.4]
R19  Res2  value 1K  [AXIAL-0.4]
R20  Res2  value 1K  [AXIAL-0.4]
U22  TLV3501AIDR  [SOIC127P599X175-8N]
U23  SN7414N  [DIP794W45P254L1969H508Q14]
U24  CD4043BE  [DIP794W45P254L1969H508Q16]
U25  SN74LS175N  [DIP794W45P254L1969H508Q16]
U26  74HC08N,652  [DIP254P762X420-14]
Y4  ECS-240.0001-18-1X  [XTAL_ECS-200-20-1X]  (value not drawn)

### Nets
+5: B2.3(GND) B2.5(VCC) C44.2 C45.1 C46.1 D3.1(A) D4.2(K) J6.1 R16.2 R17.2 R18.2 U22.4(V-) U22.7(V+) U22.8(SHDN) U23.7(GND) U23.14(VCC) U24.5(EN) U24.8(VSS) U24.16(VDD) U25.8(GND) U25.16(VCC) U26.7(GND) U26.14(VCC) ; off-sheet NOT_VCC, off-sheet NOT_GND, off-sheet SR_VCC, off-sheet SR_GND, off-sheet D_VCC, off-sheet D_GND, off-sheet AND_VCC, off-sheet AND_GND, off-sheet TVL_VCC, off-sheet TVL_GND, off-sheet GWH_GND, off-sheet GWH_VCC  [also labelled AND_GND, AND_VCC, D_GND, D_VCC, GND, GWH_GND, GWH_VCC, NOT_GND, NOT_VCC, SR_GND, SR_VCC, TVL_GND, TVL_VCC]  [project net Atmega_AVCC]
CLK: U26.6(2Y) ; off-sheet CLK
PC4: U24.4(S1) ; off-sheet PC4
PC5: U24.3(R1) ; off-sheet PC5
SIG: U26.3(1Y) ; off-sheet SIG
NetB2_1: B2.1(X1) U22.6(OUT)
NetB2_4: B2.4(Q) U25.9(CLK) U26.2(1B)
NetC43_1: C43.1 R12.2 R16.1 U22.3(IN+)
NetC43_2: C43.2 D3.2(K) D4.1(A) R14.1
NetC44_1: C44.1 R13.2 R15.1 U22.2(IN-)
NetC45_2: C45.2 R19.2 U23.1(1A) Y4.1
NetC46_2: C46.2 R20.2 Y4.2
NetJ6_2: J6.2 R14.2 R18.1
NetR12_1: R12.1 R13.1
NetR15_2: R15.2 R17.1
NetR19_1: R19.1 R20.1 U23.2(1Y) U23.3(2A)
NetU23_4: U23.4(2Y) U26.5(2B)
NetU24_2: U24.2(Q1) U25.4(1D)
NetU25_2: U25.2(1Q) U26.1(1A) U26.4(2A)

Not connected (* = marked no-connect by the designer): B2 2(X2)*; U23 5(3A)* 6(3Y)* 8(4Y)* 9(4A)* 10(5Y)* 11(5A)* 12(6Y)* 13(6A)*; U24 1(Q4)* 6(S2)* 7(R2)* 9(Q2)* 10(Q3)* 11(R3)* 12(S3)* 14(S4)* 15(R4)*; U25 1(~{CLR})* 3(1~Q)* 5(2D)* 6(2~Q)* 7(2Q)* 10(3Q)* 11(3~Q)* 12(3D)* 13(4D)* 14(4~Q)* 15(4Q)*; U26 8(3Y)* 9(3A)* 10(3B)* 11(4Y)* 12(4A)* 13(4B)*

### Notes on the sheet
- Input
- 4
- 1 in 3
- 1.0v
- Hiruna Vishwamith

### Library data of the parts
B2 = 74AHC1G4208GWH: as B1 on sheet FC_schemetic; Manufacturer_Part_Number: 74AHC1G4208GWH; Mouser Part Number: 771-74AHC1G4208GWH; Mouser Price/Stock: https://www.mouser.co.uk/ProductDetail/Nexperia/74AHC1G4208GWH?qs=17u8i%2FzlE8%2FxKrIMt8zS2A%3D%3D; Arrow Part Number: 74AHC1G4208GWH; Arrow Price/Stock: https://www.arrow.com/en/products/74ahc1g4208gwh/nexperia?region=nac; Datasheet Link: https://assets.nexperia.com/documents/data-sheet/74AHC1G4208.pdf
C43-C46 = SR201C223KAR: as C1 on sheet FC_schemetic; Manufacturer_Part_Number: SR201C223KAR; Mouser Part Number: *; Mouser Price/Stock: *; Arrow Part Number: SR201C223KAR; Arrow Price/Stock: https://www.arrow.com/en/products/sr201c223kar/avx; Datasheet Link: http://datasheets.avx.com/SR-Series.pdf
D3 D4 = CMP-004-00000-2: as D1 on sheet FC_schemetic; Datasheet URL: http://www.nxp.com/documents/data_sheet/1N4148_1N4448.pdf; Min Operating Temperature: -65°C; Manufacturer URL: https://www.fairchildsemi.com/; Packaging: Bulk; Diameter: 1.91mm; Pins: 2; Package URL: http://www.nxp.com/documents/data_sheet/1N4148_1N4448.pdf; Package Reference: SOD27; Max Operating Temperature: 175°C; Package Quantity: 2000; Case/Package: DO; Datasheet Version: Aug-04; RoHS Compliant: True
J6 = M22-2010205: as J1 on sheet FC_schemetic; Manufacturer_Name: Harwin; Manufacturer_Part_Number: M22-2010205; Mouser Part Number: 855-M22-2010205; Mouser Price/Stock: https://www.mouser.co.uk/ProductDetail/Harwin/M22-2010205?qs=xxdqPuaJ%252Ba2I8VeWvpQIzQ%3D%3D; Arrow Part Number: *; Arrow Price/Stock: *; Datasheet Link: http://uk.rs-online.com/web/p/products/6813287
R12-R20 = Res2: Resistor; Published: 8-Jun-2000; LatestRevisionDate: 17-Jul-2002; LatestRevisionNote: Re-released for DXP Platform.; PackageReference: AXIAL-0.4; Publisher: Altium Limited; PackageDescription: Axial Device, Thru-Hole; 2 Leads; 0.4 in Pin Spacing
U22 = TLV3501AIDR: as U12 on sheet FC_schemetic; MP: TLV3501AIDR; Purchase-URL: https://pricing.snapeda.com/search/part/TLV3501AIDR/?ref=eda; Package: SOIC-8 Texas Instruments; Value: *; Digi-Key_Part_Number: 296-43611-1-ND; Check_prices: https://www.snapeda.com/parts/TLV3501AIDR/Texas+Instruments/view-part/?ref=eda; SnapEDA_Link: https://www.snapeda.com/parts/TLV3501AIDR/Texas+Instruments/view-part/?ref=snap
U23 = SN7414N: as U5 on sheet FC_schemetic; Price: None; MP: SN7414N; DigiKey-Purchase-URL: https://snapeda.com/shop?store=DigiKey&id=51455; Value: *; Package: PDIP-14 Texas Instruments; Mouser-Purchase-URL: https://snapeda.com/shop?store=Mouser&id=51455; SnapEDA_Link: https://www.snapeda.com/parts/SN7414N/Texas%20Instruments/view-part/51455/?ref=snap; Availability: Warning; Texas_Instruments-Purchase-URL: https://snapeda.com/shop?store=Texas+Instruments&id=51455; Check_prices: https://www.snapeda.com/parts/SN7414N/Texas%20Instruments/view-part/51455/?ref=eda
U24 = CD4043BE: as U2 on sheet FC_schemetic; Value: *; Arrow_Electronics-Purchase-URL: https://snapeda.com/shop?store=Arrow+Electronics&id=577167; Package: PDIP-16 Texas Instruments; DigiKey-Purchase-URL: https://snapeda.com/shop?store=DigiKey&id=577167; Mouser-Purchase-URL: https://snapeda.com/shop?store=Mouser&id=577167; Price: None; MP: CD4043BE; Availability: Good; SnapEDA_Link: https://www.snapeda.com/parts/CD4043BE/Texas%20Instruments/view-part/577167/?ref=snap; Texas_Instruments-Purchase-URL: https://snapeda.com/shop?store=Texas+Instruments&id=577167; BuyPart: https://www.snapeda.com/parts/CD4043BE/Texas%20Instruments/view-part/577167/?ref=eda
U25 = SN74LS175N: as U3 on sheet FC_schemetic; MP: SN74LS175N; SnapEDA_Link: https://www.snapeda.com/parts/SN74LS175N/Texas%20Instruments/view-part/572262/?ref=snap; Package: PDIP-16 Texas Instruments; Value: *; Check_prices: https://www.snapeda.com/parts/SN74LS175N/Texas%20Instruments/view-part/572262/?ref=eda; Purchase-URL: https://pricing.snapeda.com/search/part/SN74LS175N/?ref=eda; Digi-Key_Part_Number: 296-28719-2-ND
U26 = 74HC08N,652: as U4 on sheet FC_schemetic; Availability: Warning; MP: 74HC08N,652; DigiKey-Purchase-URL: https://snapeda.com/shop?store=DigiKey&id=41634; Value: *; SnapEDA_Link: https://www.snapeda.com/parts/74HC08N,652/NXP%20USA%20Inc./view-part/41634/?ref=snap; Price: None; Package: DIP-14 NXP Semiconductors; BuyPart: https://www.snapeda.com/parts/74HC08N,652/NXP%20USA%20Inc./view-part/41634/?ref=eda
Y4 = ECS-240.0001-18-1X: as Y1 on sheet FC_schemetic; Package: HC49/U ECS International; Availability: Unavailable; Value: *; MP: ECS-240.0001-18-1X; Price: None; SnapEDA_Link: https://www.snapeda.com/parts/ECS-240.0001-18-1X/ECS%20International/view-part/259232/?ref=snap

## Nets that join several sheets
Atmega_AVCC: FC_schemetic (85 pins), CPU (44 pins), Process (16 pins), Input (23 pins)
CLK: Process (U19.11 U19.13), Input (U26.6)
PA0: CPU (U15.40), Process (U16.15 U17.15 U18.15)
PA1: CPU (U15.39), Process (U16.1 U17.1 U18.1)
PA2: CPU (U15.38), Process (U16.2 U17.2 U18.2)
PA3: CPU (U15.37), Process (U16.3 U17.3 U18.3)
PA4: CPU (U15.36), Process (U16.4 U17.4 U18.4)
PA5: CPU (U15.35), Process (U16.5 U17.5 U18.5)
PA6: CPU (U15.34), Process (U16.6 U17.6 U18.6)
PA7: CPU (U15.33), Process (U16.7 U17.7 U18.7)
PB0: CPU (U15.1), Process (U19.15 U20.15)
PB1: CPU (U15.2), Process (U19.1 U20.1)
PB2: CPU (U15.3), Process (U19.2 U20.2)
PB3: CPU (U15.4), Process (U19.3 U20.3)
PB4: CPU (U15.5), Process (U19.4 U20.4)
PB5: CPU (U15.6), Process (U19.5 U20.5)
PB6: CPU (U15.7), Process (U19.6 U20.6)
PB7: CPU (U15.8), Process (U19.7 U20.7)
PC0: CPU (U15.22), Process (U16.14 U19.14)
PC1: CPU (U15.23), Process (U17.14 U20.14)
PC2: CPU (U15.24), Process (U18.14 U21.14)
PC3: CPU (U15.25), Process (6 pins)
PC4: CPU (U15.26), Input (U24.4)
PC5: CPU (U15.27), Input (U24.3)
SIG: Process (U16.11 U16.13), Input (U26.3)